# Altium schematic sheet LED.SchDoc
size A4; SheetNumber: 3; SheetTotal: 4
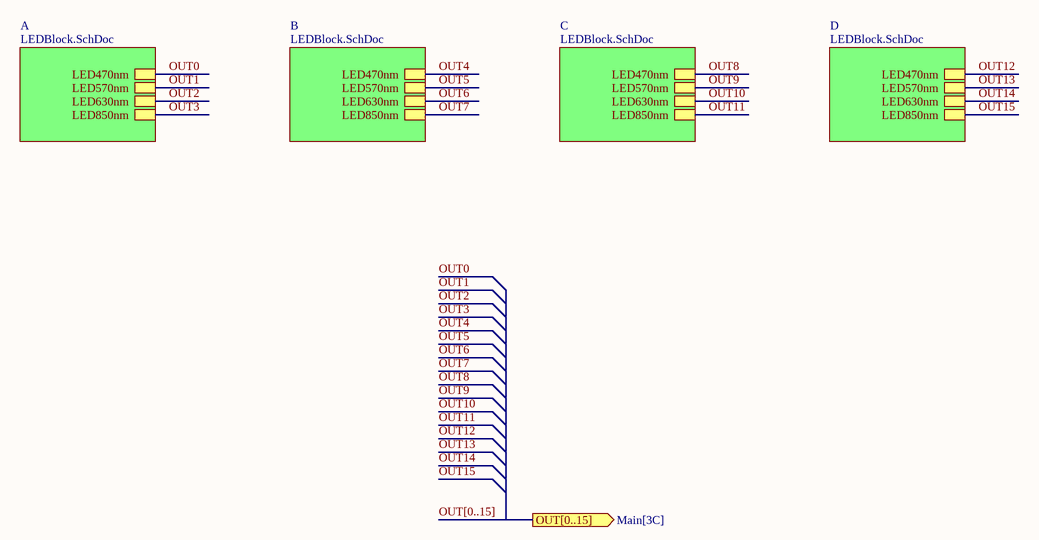
[diagram p0: LED.SchDoc]

## Sub-sheets
A = LEDBlock.SchDoc: LED470nm, LED570nm, LED630nm, LED850nm
B = LEDBlock.SchDoc: LED470nm, LED570nm, LED630nm, LED850nm
C = LEDBlock.SchDoc: LED470nm, LED570nm, LED630nm, LED850nm
D = LEDBlock.SchDoc: LED470nm, LED570nm, LED630nm, LED850nm

## Ports
OUT[0..15] (out, see Main[3C])

## Nets
OUT0: sheet A/LED470nm
OUT1: sheet A/LED570nm
OUT2: sheet A/LED630nm
OUT3: sheet A/LED850nm
OUT4: sheet B/LED470nm
OUT5: sheet B/LED570nm
OUT6: sheet B/LED630nm
OUT7: sheet B/LED850nm
OUT8: sheet C/LED470nm
OUT9: sheet C/LED570nm
OUT10: sheet C/LED630nm
OUT11: sheet C/LED850nm
OUT12: sheet D/LED470nm
OUT13: sheet D/LED570nm
OUT14: sheet D/LED630nm
OUT15: sheet D/LED850nm

## Buses and harness runs
bus OUT[0..15] = port OUT[0..15]